# Altium schematic sheet RF_LoRa.SchDoc
size A; SheetNumber: 4; SheetTotal: 9
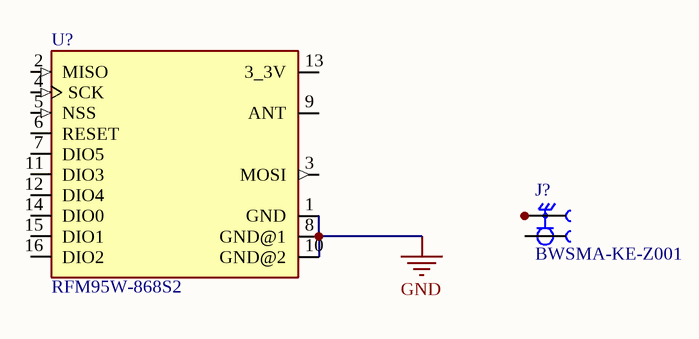
[diagram p0: RF_LoRa.SchDoc]

## Parts
J?  BWSMA-KE-Z001  [BAT_WIRELESS_BWSMA-KE-Z001]
U?  RFM95W-868S2  [XCVR_RFM95W-868S2]

## Nets
GND: U?.1(GND) U?.8(GND@1) U?.10(GND@2)
NetJ?_2_1: J?.2_1 J?.2_2 J?.2_3 J?.2_4

Not connected (* = marked no-connect by the designer): J? 1; U? 2(MISO) 3(MOSI) 4(SCK) 5(NSS) 6(RESET) 7(DIO5) 9(ANT) 11(DIO3) 12(DIO4) 13(3_3V) 14(DIO0) 15(DIO1) 16(DIO2)

## Library data of the parts
J? = BWSMA-KE-Z001: 1 Inner bore SMA Board Edge Positive foot -65â„ƒ~+165â„ƒ 50Î© Plugin RF Connectors / Coaxial Connectors ROHS; MF: Bat Wireless; SnapEDA_Link: https://www.snapeda.com/parts/BWSMA-KE-Z001/Bat+Wireless/view-part/?ref=snap; Package: None; Value: *; MP: BWSMA-KE-Z001; Check_prices: https://www.snapeda.com/parts/BWSMA-KE-Z001/Bat+Wireless/view-part/?ref=eda
U? = RFM95W-868S2: General ISM < 1GHz LoRaâ„¢ Transceiver Module 868MHz Antenna Not Included Surface Mount; MF: RF; Package: Non Standard RF Solutions; Price: None; Check_prices: https://www.snapeda.com/parts/RFM95W-868S2/RF+Solutions/view-part/?ref=eda; Value: *; SnapEDA_Link: https://www.snapeda.com/parts/RFM95W-868S2/RF+Solutions/view-part/?ref=snap; MP: RFM95W-868S2; Availability: In Stock; Purchase-URL: https://pricing.snapeda.com/search?q=RFM95W-868S2&ref=eda